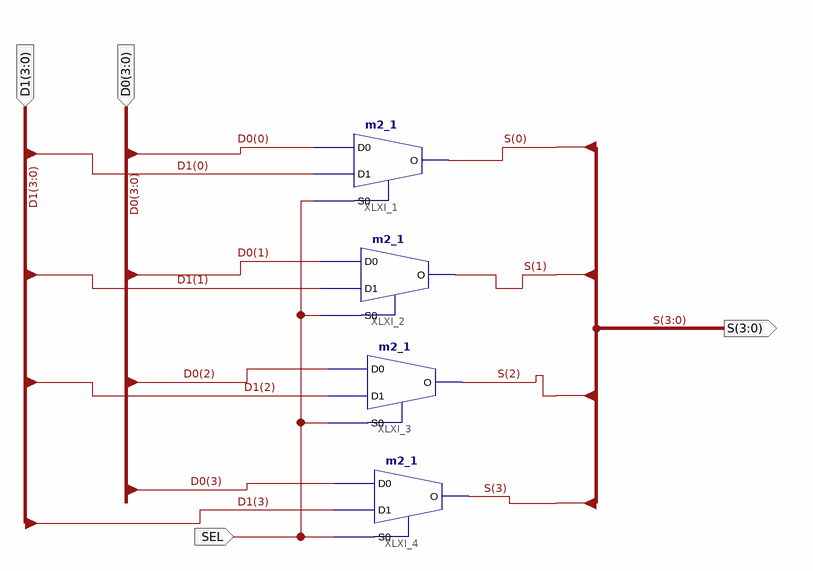
[diagram p0: schematic sheet 1]
// Xilinx ISE schematic mux2_4bits.sch (spartan3e) as structural Verilog: 4 symbols, 4 ports
module mux2_4bits (
  input  [3:0] D0,
  input  [3:0] D1,
  input  SEL,
  output [3:0] S
);

  m2_1 XLXI_1 (.D0(D0[0]), .D1(D1[0]), .S0(SEL), .O(S[0]));
  m2_1 XLXI_2 (.D0(D0[1]), .D1(D1[1]), .S0(SEL), .O(S[1]));
  m2_1 XLXI_3 (.D0(D0[2]), .D1(D1[2]), .S0(SEL), .O(S[2]));
  m2_1 XLXI_4 (.D0(D0[3]), .D1(D1[3]), .S0(SEL), .O(S[3]));
endmodule
